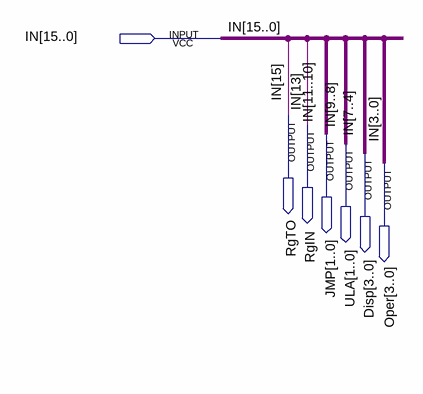
[diagram p0: schematic sheet]
// Quartus schematic rom_separator.bdf as structural Verilog: 0 symbols, 7 pins
module rom_separator (
  input  [15:0] IN,
  output RgTO,
  output RgIN,
  output [1:0] JMP,
  output [1:0] ULA,
  output [3:0] Disp,
  output [3:0] Oper
);


  assign Disp = IN[7:4];
  assign JMP = IN[11:10];
  assign Oper = IN[3:0];
  assign RgIN = IN[13];
  assign RgTO = IN[15];
  assign ULA = IN[9:8];
endmodule
